# EAGLE design Development board ESP-07 with ProgSwitch (EAGLE 7.4.0)
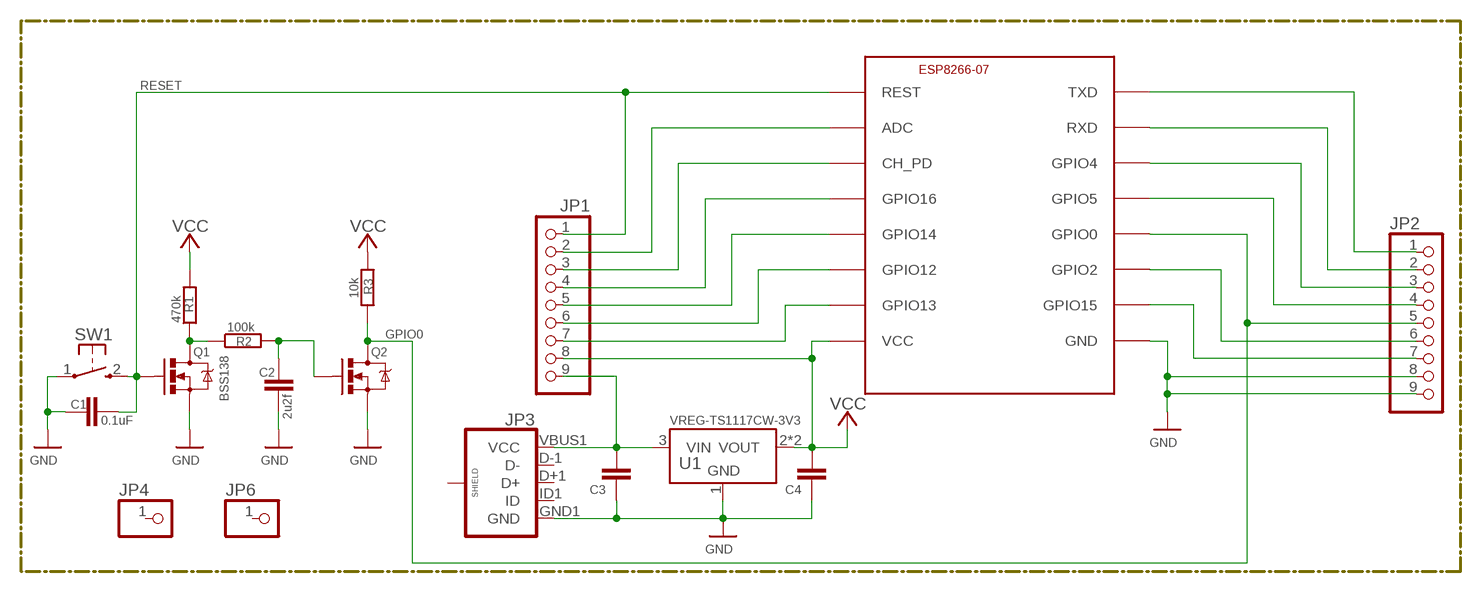
[diagram p0: schematic, sheet 1]

## Parts
C1  0.1uF  C-EU025-024X044  [C025-024X044]
C2  2u2f  C-EU025-024X044  [C025-024X044]
C3  C-EU025-024X044  [C025-024X044]
C4  C-EU025-024X044  [C025-024X044]
ESP8266-07  ESP8266-07  [ESP-07]
JP1  PINHD-1X91X09_SMT  [1X09_SMT]
JP2  PINHD-1X91X09_SMT  [1X09_SMT]
JP3  USB_MICROB_PLUGCONN-11752  [USB-B-MICRO-SMD_V03]
JP4  PINHD-1X1  [1X01]
JP6  PINHD-1X1  [1X01]
Q1  BSS138  MOSFET-NCHANNELAO3404A  [SOT23-3]
Q2  BSS138  MOSFET-NCHANNELAO3404A  [SOT23-3]
R1  470k  R-EU_R1206  [R1206]
R2  100k  R-EU_R1206  [R1206]
R3  10k  R-EU_R1206  [R1206]
SW1  KSS-2EG4430  [KSS-2EG4430]
U1  VREG-TS1117CW-3V3  [SOT223]

## Nets
GND: C1.1 C2.1 C3.1 C4.1 ESP8266-07.GND JP2.8 JP2.9 JP3.GND1(GND) Q1.2(S) Q2.2(S) SW1.1(P) U1.1(GND)
GPIO0: ESP8266-07.GPIO0 JP2.5 Q2.3(D) R3.2
N$1: ESP8266-07.TXD JP2.1
N$2: ESP8266-07.RXD JP2.2
N$3: Q1.3(D) R1.1 R2.1
N$4: C2.2 Q2.1(G) R2.2
N$5: ESP8266-07.GPIO5 JP2.4
N$6: ESP8266-07.VCC JP1.8
N$7: ESP8266-07.GPIO2 JP2.6
N$8: ESP8266-07.GPIO15 JP2.7
N$11: ESP8266-07.ADC JP1.2
N$12: ESP8266-07.CH_PD JP1.3
N$13: ESP8266-07.GPIO16 JP1.4
N$14: ESP8266-07.GPIO14 JP1.5
N$15: ESP8266-07.GPIO12 JP1.6
N$16: C3.2 JP1.9 JP3.VBUS1(VCC) U1.3(VIN)
N$17: ESP8266-07.GPIO13 JP1.7
N$24: ESP8266-07.GPIO4 JP2.3
RESET: C1.2 ESP8266-07.REST JP1.1 Q1.1(G) SW1.2(S)
VCC: C4.2 R1.2 R3.1 U1.2(VOUT) U1.4(VOUT)
Unconnected: JP3.D+1(D+) JP3.D-1(D-) JP3.ID1(ID) JP3.SHIELD1(SHIELD) JP3.SHIELD2(SHIELD) JP3.SHIELD3(SHIELD) JP4.1 JP6.1

## Library data of the parts
C1-C4 = rcl:C-EU: CAPACITOR, European symbol
ESP8266-07 = lio:ESP8266
JP1 JP2 = pinhead+:PINHD-1X9: PIN HEADER
JP3 = SparkFun-Connectors:USB_MICROB_PLUG: USB Micro-B connectors Some male, some female. Watch your step!; PROD_ID: CONN-11752
JP4 JP6 = pinhead+:PINHD-1X1: PIN HEADER
Q1 Q2 = SparkFun-DiscreteSemi:MOSFET-NCHANNEL: Common NMOSFET Parts MFG P/N Store ID Prod ID FDD8780 TRANS-09984 SI7820DN TRANS-11055 FDS6630A IC-08089 2N7002PW TRANS-11151 FQP30N06L COM-10213 TRANS-10060 BSS123LT1G TRANS-08345 BSS138 TRANS-00830 BS170 2N7000; PROD_ID: TRAN-12988
R1-R3 = rcl:R-EU_: RESISTOR, European symbol
SW1 = buttons:KSS-2EG4430: Size: 3x6mm Height: 5mm from PCB Rating: DC12v 50mA Travel: 0.25±0.10mm Operating Force: 180±50gf Return Force: 60gf min Contact resistance: 100m? max Insulation resistance: 100M? min Operating life?50,000 cycles
U1 = we-power:VREG: Voltage Regulators (LDOs, Switching Converters...) LDOs Taiwan Semi TS1117 800mA max 15V - compatible On Semi NCP1117 1A max 20V Taiwan Semi TS9011 250mA max 12V - compatible Diodes AP2210 300mA max 15V Taiwan Semi TS5204 150mA max 16V DC/DC Converter Modules Recom R-78Ex.x-1.0-W36 1A max 28V Murata OKI-78SR-x.x/1.5-W36 1.5A max 36V

## Board
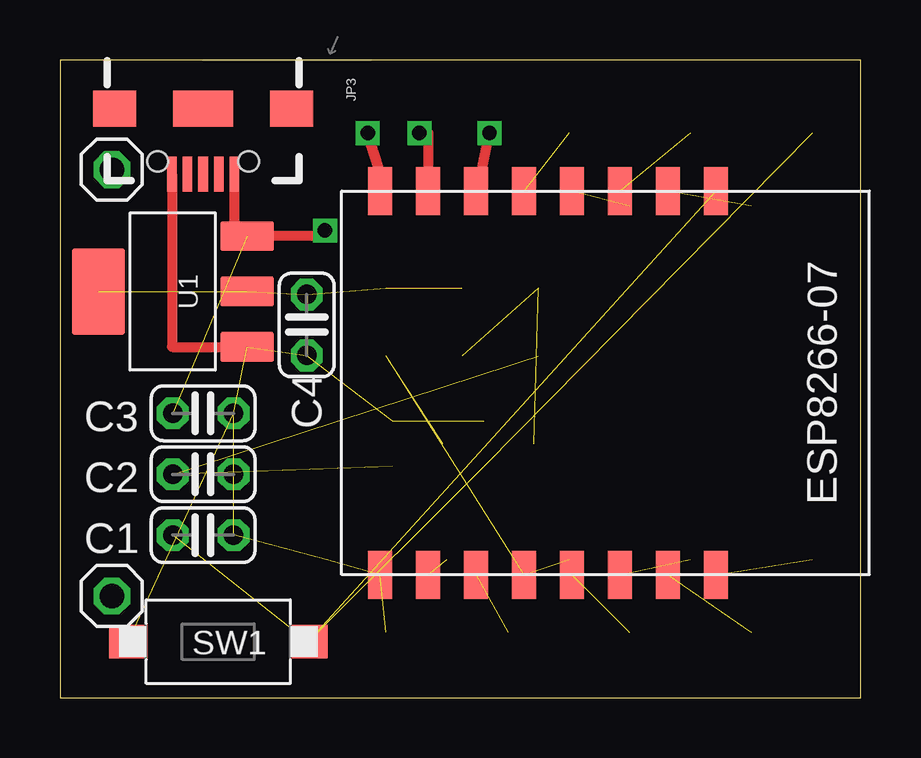
[diagram p1: board, top side]
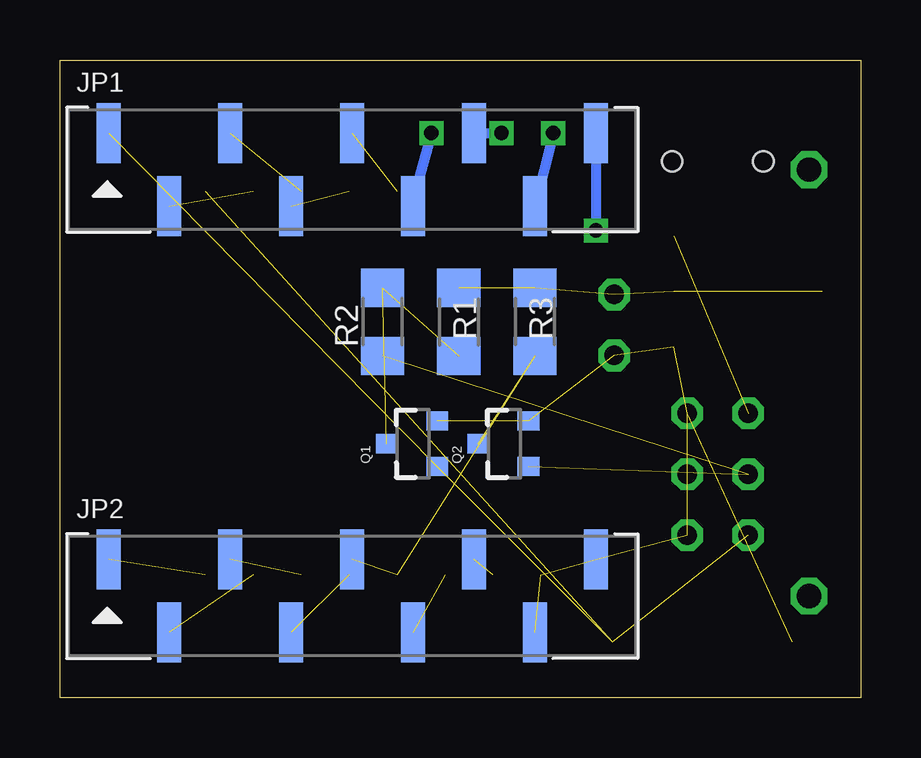
[diagram p2: board, bottom side, seen from below]

Size 33.39 x 26.59 mm. Coordinates in mm from the lower left corner, seen from the top.
Outline: 0,26.59 0,0 33.39,0 33.39,26.59 0,26.59
Copper layers (1*16): Top 0.035mm / dielectric 1.5mm / Bottom 0.035mm
Design rules "default": minimum track width 10mil, minimum drill 24mil, track to track 8mil, track to pad 8mil, pad to pad 8mil, via to via 8mil, smd to smd 8mil, copper to edge 40mil, drill to drill 8mil, minimum pad ring 10mil, minimum via ring 8mil, stop-mask expansion 4mil, vias tented up to drill 0mil, thermal gap 10mil

### Footprints (pad centres in the part's own frame; a part is rotated, then mirrored left to right if it is on the bottom)
C025-024X044 = drill 0.813 octagon: 1 -1.27,0; 2 1.27,0
ESP-07 = smd 1 x 2: ADC -1.6,-8; CH_PD 0.4,-8; GND 10.4,8; GPIO0 4.4,8; GPIO2 6.4,8; GPIO4 0.4,8; GPIO5 2.4,8; GPIO12 6.4,-8; GPIO13 8.4,-8; GPIO14 4.4,-8; GPIO15 8.4,8; GPIO16 2.4,-8; REST -3.6,-8; RXD -1.6,8; TXD -3.6,8; VCC 10.4,-8
1X09_SMT = smd 1 x 2.5: 1 -10.16,1.52; 2 -7.62,-1.52; 3 -5.08,1.52; 4 -2.54,-1.52; 5 0,1.52; 6 2.54,-1.52; 7 5.08,1.52; 8 7.62,-1.52; 9 10.16,1.52
USB-B-MICRO-SMD_V03 = smd 1.45 x 0.4: D+1 2.725,0; D-1 2.725,0.65; GND1 2.725,-1.3; ID1 2.725,-0.65; VBUS1 2.725,1.3 | smd 1.5 x 1.8: SHIELD1 0,3.685; SHIELD2 0,-3.685 | smd 1.5 x 2.5: SHIELD3 0,0 | hole 0.85: 2.2,1.9; 2.2,-1.9
1X01 = drill 1.016 octagon: 1 0,0
SOT23-3 = smd 0.8 x 0.9: 1 -0.95,-1; 2 0.95,-1; 3 0,1.1
R1206 = smd 1.6 x 1.803: 1 -1.422,0; 2 1.422,0
KSS-2EG4430 = smd 1.6 x 1.4: 1 -3.75,0; 2 3.75,0
SOT223 = smd 2.235 x 1.219: 1 -3.099,2.311; 2 -3.099,0; 3 -3.099,-2.311 | smd 2.2 x 3.6: 4 3.099,0

### Placement (x,y rotation side)
C1  5.97,6.78 180 top
C2  5.97,9.32 180 top
C3  5.97,11.86 180 top
C4  10.29,15.54 90 top
ESP8266-07  23.75,13.13 180 top
JP1  21.21,22.02 0 bottom
JP2  21.21,4.24 0 bottom
JP3  5.97,24.56 270 top
JP4  2.16,22.02 270 top
JP6  2.16,4.24 270 top
Q1  18.67,10.59 90 bottom
Q2  14.86,10.59 90 bottom
R1  16.76,15.67 90 bottom
R2  19.94,15.67 270 bottom
R3  13.59,15.67 270 bottom
SW1  6.6,2.34 0 top
U1  4.7,16.94 180 top

### Tracks (layer width: path | path; a pad name or v marks a point on that pad's centre or on a via)
GND  (10 unrouted)
  Top 0.406: JP3.GND1 4.67,14.63 U1.1
GPIO0  (3 unrouted)
N$1  (1 unrouted)
N$2  (1 unrouted)
N$3  (2 unrouted)
N$4  (2 unrouted)
N$5  (1 unrouted)
N$6  (via drill 0.6)
  Top 0.406: ESP8266-07.VCC 13.59,21.13 v12.83,23.55
  Bottom 0.406: v12.83,23.55 JP1.8
N$7  (1 unrouted)
N$8  (1 unrouted)
N$11  (1 unrouted)
N$12  (1 unrouted)
N$13  (1 unrouted)
N$14  (1 unrouted)
N$15  (via drill 0.6)
  Top 0.406: ESP8266-07.GPIO12 17.4,21.13 v17.91,23.55
  Bottom 0.406: v17.91,23.55 18.67,20.75 JP1.6
N$16  (via drill 0.6)  (1 unrouted)
  Top 0.406: JP3.VBUS1 7.27,19.25 U1.3 11.05,19.25 v11.05,19.48
  Bottom 0.406: JP1.9 v11.05,19.48
N$17  (via drill 0.6)
  Top 0.406: v14.99,23.55 15.35,23.55 ESP8266-07.GPIO13
  Bottom 0.406: JP1.7 v14.99,23.54 v14.99,23.55
N$24  (1 unrouted)
RESET  (4 unrouted)
VCC  (4 unrouted)